# EAGLE design servo2 (EAGLE 7.5.0)
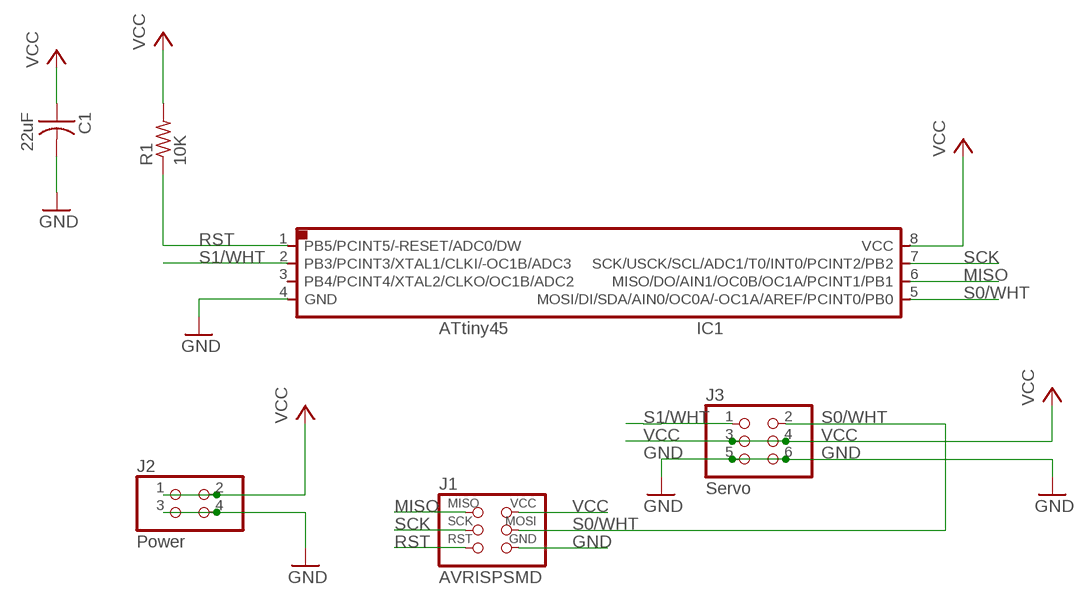
[diagram p0: schematic, sheet 1]

## Parts
C1  22uF  CAP-US1206FAB  [C1206FAB]
IC1  ATTINY45SI  [SOIC8]
J1  AVRISPSMD  [2X03SMD]
J2  Power  PINHD-2X2-SMD  [2X02SMD]
J3  Servo  PINHD-2X3-SMD  [2X03SMD]
R1  10K  RES-US1206FAB  [R1206FAB]

## Nets
GND: C1.2 IC1.4(GND) J1.6(GND) J2.3 J2.4 J3.5 J3.6
MISO: IC1.6(MISO/DO/AIN1/OC0B/OC1A/PCINT1/PB1) J1.1(MISO)
RST: IC1.1(PB5/PCINT5/-RESET/ADC0/DW) J1.5(RST) R1.1
S0/WHT: IC1.5(MOSI/DI/SDA/AIN0/OC0A/-OC1A/AREF/PCINT0/PB0) J1.4(MOSI) J3.2
S1/WHT: IC1.2(PB3/PCINT3/XTAL1/CLKI/-OC1B/ADC3) J3.1
SCK: IC1.7(SCK/USCK/SCL/ADC1/T0/INT0/PCINT2/PB2) J1.3(SCK)
VCC: C1.1 IC1.8(VCC) J1.2(VCC) J2.1 J2.2 J3.3 J3.4 R1.2
Unconnected: IC1.3(PB4/PCINT4/XTAL2/CLKO/OC1B/ADC2)

## Library data of the parts
C1 = fab:CAP-US
IC1 = fab:ATTINY45
J1 = fab:AVRISP
J2 = fab:PINHD-2X2-SMD
J3 = fab:PINHD-2X3-SMD: PIN HEADER
R1 = fab:RES-US: Resistor (US Symbol) Variants with postfix FAB are widened to allow the routing of internal traces

## Board
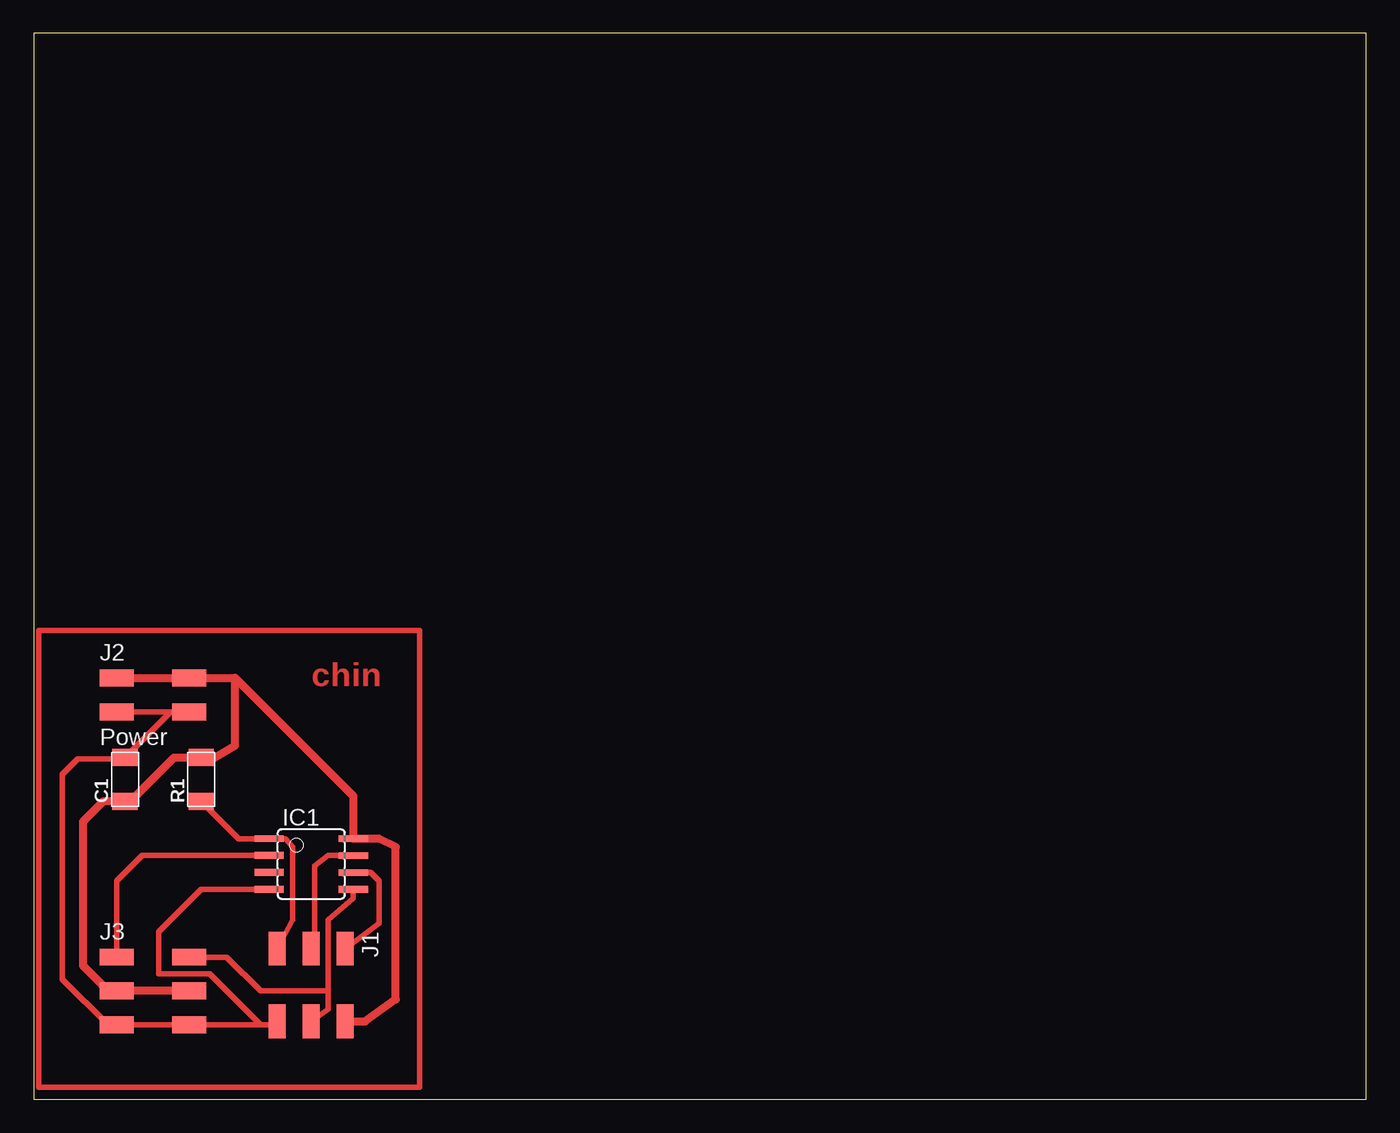
[diagram p1: board, top side]

Size 100 x 80 mm. Coordinates in mm from the lower left corner, seen from the top.
Outline: 0,0 100,0 100,80 0,80 0,0
Copper layers (1*16): Top 0.035mm / dielectric 1.5mm / Bottom 0.035mm
Design rules "default": minimum track width 10mil, minimum drill 24mil, track to track 8mil, track to pad 8mil, pad to pad 8mil, via to via 8mil, smd to smd 8mil, copper to edge 40mil, drill to drill 8mil, minimum pad ring 10mil, minimum via ring 8mil, stop-mask expansion 4mil, vias tented up to drill 0mil, thermal gap 10mil

### Footprints (pad centres in the part's own frame; a part is rotated, then mirrored left to right if it is on the bottom)
C1206FAB = smd 1.27 x 1.905: 1 -1.651,0; 2 1.651,0
SOIC8 = smd 0.5 x 2.2: 1 -1.905,-3.154; 2 -0.645,-3.154; 3 0.625,-3.154; 4 1.895,-3.154; 5 1.905,3.154; 6 0.635,3.154; 7 -0.635,3.154; 8 -1.905,3.154
2X03SMD = smd 2.54 x 1.27: 1 -2.54,2.54; 2 2.92,2.54; 3 -2.54,0; 4 2.92,0; 5 -2.54,-2.54; 6 2.92,-2.54
2X02SMD = smd 2.54 x 1.27: 1 -2.54,1.27; 2 2.92,1.27; 3 -2.54,-1.27; 4 2.92,-1.27
R1206FAB = smd 1.27 x 1.905: 1 -1.651,0; 2 1.651,0

### Placement (x,y rotation side)
C1  6.86,24 90 top
IC1  20.83,17.65 270 top
J1  20.83,8.76 270 top
J2  8.76,30.35 0 top
J3  8.76,8.13 0 top
R1  12.57,24 90 top

### Tracks (layer width: path | path; a pad name or v marks a point on that pad's centre or on a via)
GND
  Top 0.406: J2.3 J2.4 10.29,29.08 C1.2 6.73,25.53 3.3,25.53 2.16,24.38 2.16,9.02 5.59,5.59 J3.5 J3.6 17.02,5.59 | 17.02,5.59 17.91,5.59 J1.6 | IC1.4 12.58,15.76 9.4,12.57 9.4,9.4 13.21,9.4 17.02,5.59
MISO
  Top 0.406: IC1.6 25.27,17.02 25.91,16.38 25.91,13.21 J1.1
N$1
  Top 0.406: 0.38,35.18 0.38,0.89 28.96,0.89 28.96,35.18 0.38,35.18
RST
  Top 0.406: R1.1 15.37,19.56 IC1.1 18.92,19.56 19.43,18.92 19.43,13.46 J1.5
S0/WHT
  Top 0.406: IC1.5 23.98,15.09 22.1,13.46 22.1,8.13 | 22.1,8.13 22.1,6.73 J1.4 | J3.2 14.48,10.67 17.02,8.13 22.1,8.13
S1/WHT
  Top 0.406: J3.1 6.22,16.38 8.13,18.29 17.66,18.29 IC1.2
SCK
  Top 0.406: IC1.7 22.1,18.29 21.08,17.53 21.08,11.18 J1.3
VCC
  Top 0.406: C1.1 7.24,22.35 | 5.59,8.13 J3.3 | 24,19.58 IC1.8
  Top 0.61: 7.24,22.35 10.54,25.65 R1.2 13.59,25.65 15.11,26.54 15.11,31.62 | C1.1 5.21,22.35 3.68,20.83 3.68,10.03 5.59,8.13 | J3.4 J3.3 | J2.1 J2.2 15.11,31.62 | J1.2 24.89,5.84 27.18,7.49 27.18,18.92 25.91,19.56 IC1.8 23.98,22.75 15.11,31.62

### Text on the board
Top: chin